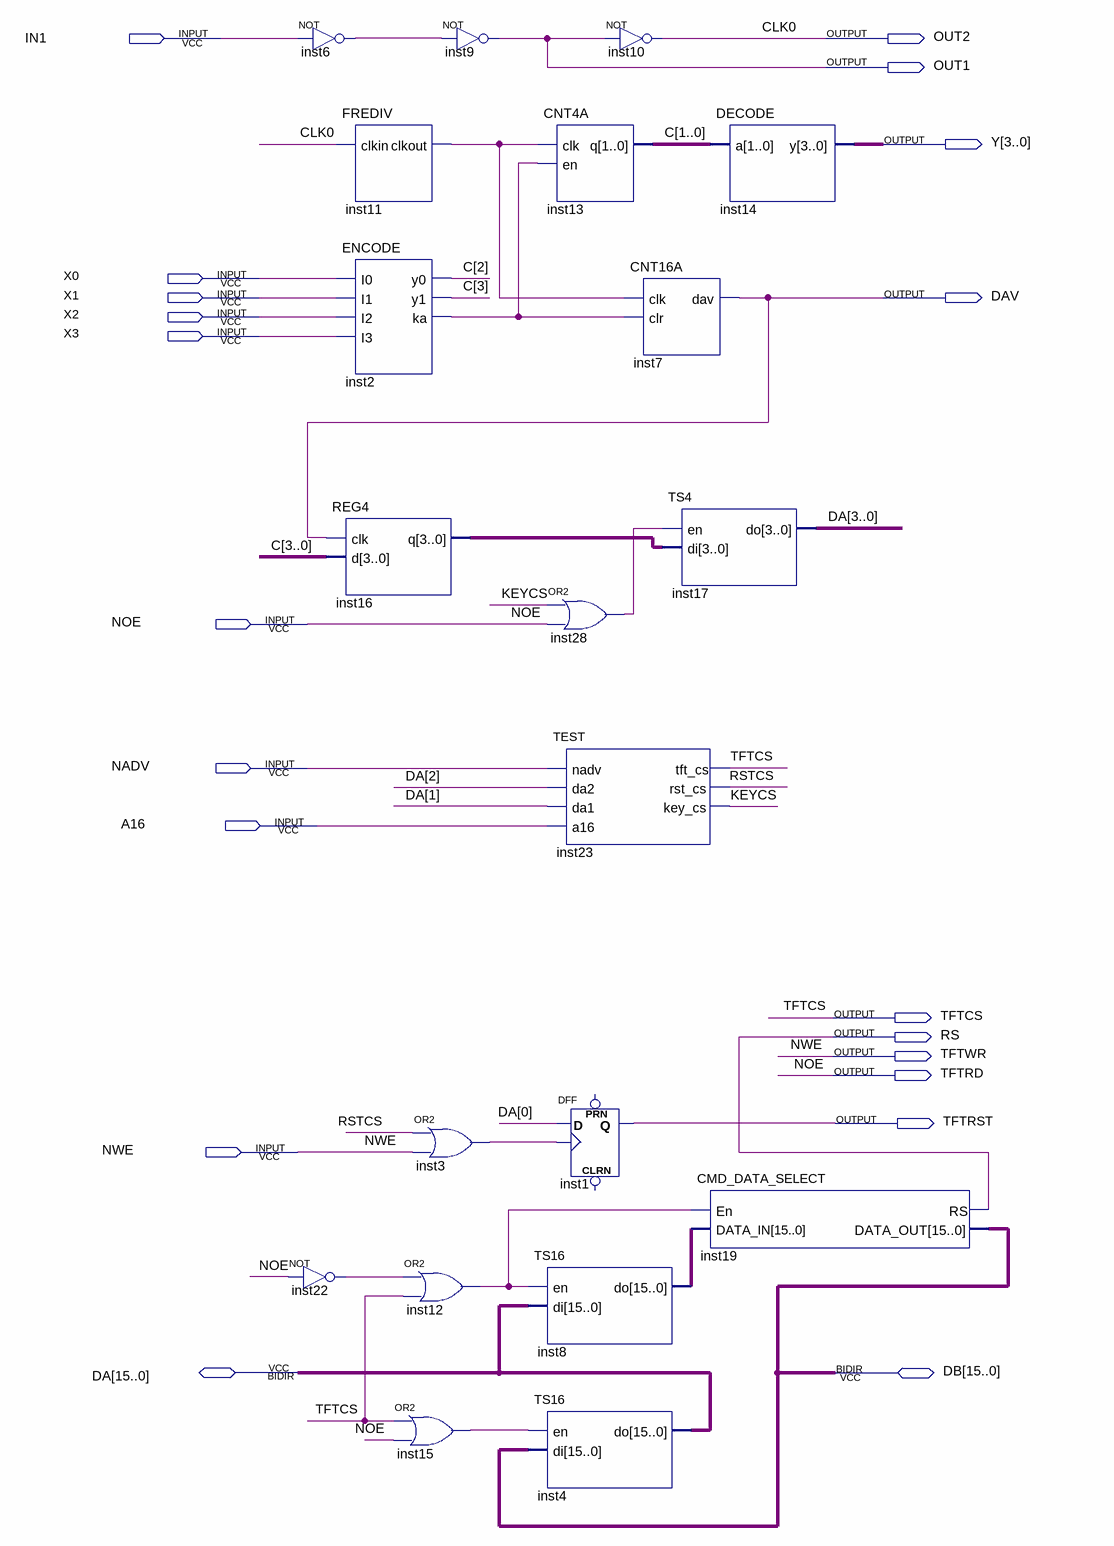
[diagram p0: schematic sheet]
// Quartus schematic TFTKEYSTM32.bdf as structural Verilog: 20 symbols, 20 pins
module TFTKEYSTM32 (
  input  IN1,
  input  X0,
  input  X1,
  input  X2,
  input  X3,
  input  NOE,
  input  NADV,
  input  A16,
  input  NWE,
  inout  [15:0] DA,
  inout  [15:0] DB,
  output OUT2,
  output OUT1,
  output [3:0] Y,
  output DAV,
  output TFTCS,
  output RS,
  output TFTWR,
  output TFTRD,
  output TFTRST
);

  wire inst2_ka, inst3_out, inst6_out, inst11_clkout, inst12_out, inst15_out, inst22_out, inst28_out, KEYCS,
       RSTCS;
  wire [3:0] C, inst16_q;
  wire [15:0] inst8_do;

  not inst6 (inst6_out, IN1);
  FREDIV inst11 (.clkin(OUT2), .clkout(inst11_clkout));
  ENCODE inst2 (.I0(X0), .I1(X1), .I2(X2), .I3(X3), .y0(C[2]), .y1(C[3]), .ka(inst2_ka));
  REG4 inst16 (.clk(DAV), .d(C), .q(inst16_q));
  not inst22 (inst22_out, NOE);
  or inst3 (inst3_out, RSTCS, NWE);
  or inst12 (inst12_out, inst22_out, TFTCS);
  or inst15 (inst15_out, TFTCS, NOE);
  not inst9 (OUT1, inst6_out);
  CNT4A inst13 (.clk(inst11_clkout), .en(inst2_ka), .q(C[1:0]));
  or inst28 (inst28_out, KEYCS, NOE);
  TEST inst23 (.nadv(NADV), .da2(DA[2]), .da1(DA[1]), .a16(A16), .tft_cs(TFTCS), .rst_cs(RSTCS), .key_cs(KEYCS));
  DFF inst1 (.CLK(inst3_out), .D(DA[0]), .Q(TFTRST));  // open: CLRN, PRN
  TS16 inst8 (.en(inst12_out), .di(DA), .\do (inst8_do));
  TS16 inst4 (.en(inst15_out), .di(DB), .\do (DA));
  not inst10 (OUT2, OUT1);
  CNT16A inst7 (.clk(inst11_clkout), .clr(inst2_ka), .dav(DAV));
  DECODE inst14 (.a(C[1:0]), .y(Y));
  TS4 inst17 (.en(inst28_out), .di(inst16_q), .\do (DA[3:0]));
  CMD_DATA_SELECT inst19 (.En(inst12_out), .DATA_IN(inst8_do), .RS(RS), .DATA_OUT(DB));

  assign TFTRD = NOE;
  assign TFTWR = NWE;

  // Other names for the same wires on the sheet: CLK0 = OUT2
endmodule
